# Altium schematic sheet Sheet1.SchDoc
size A4; SheetNumber: 1; SheetTotal: 1
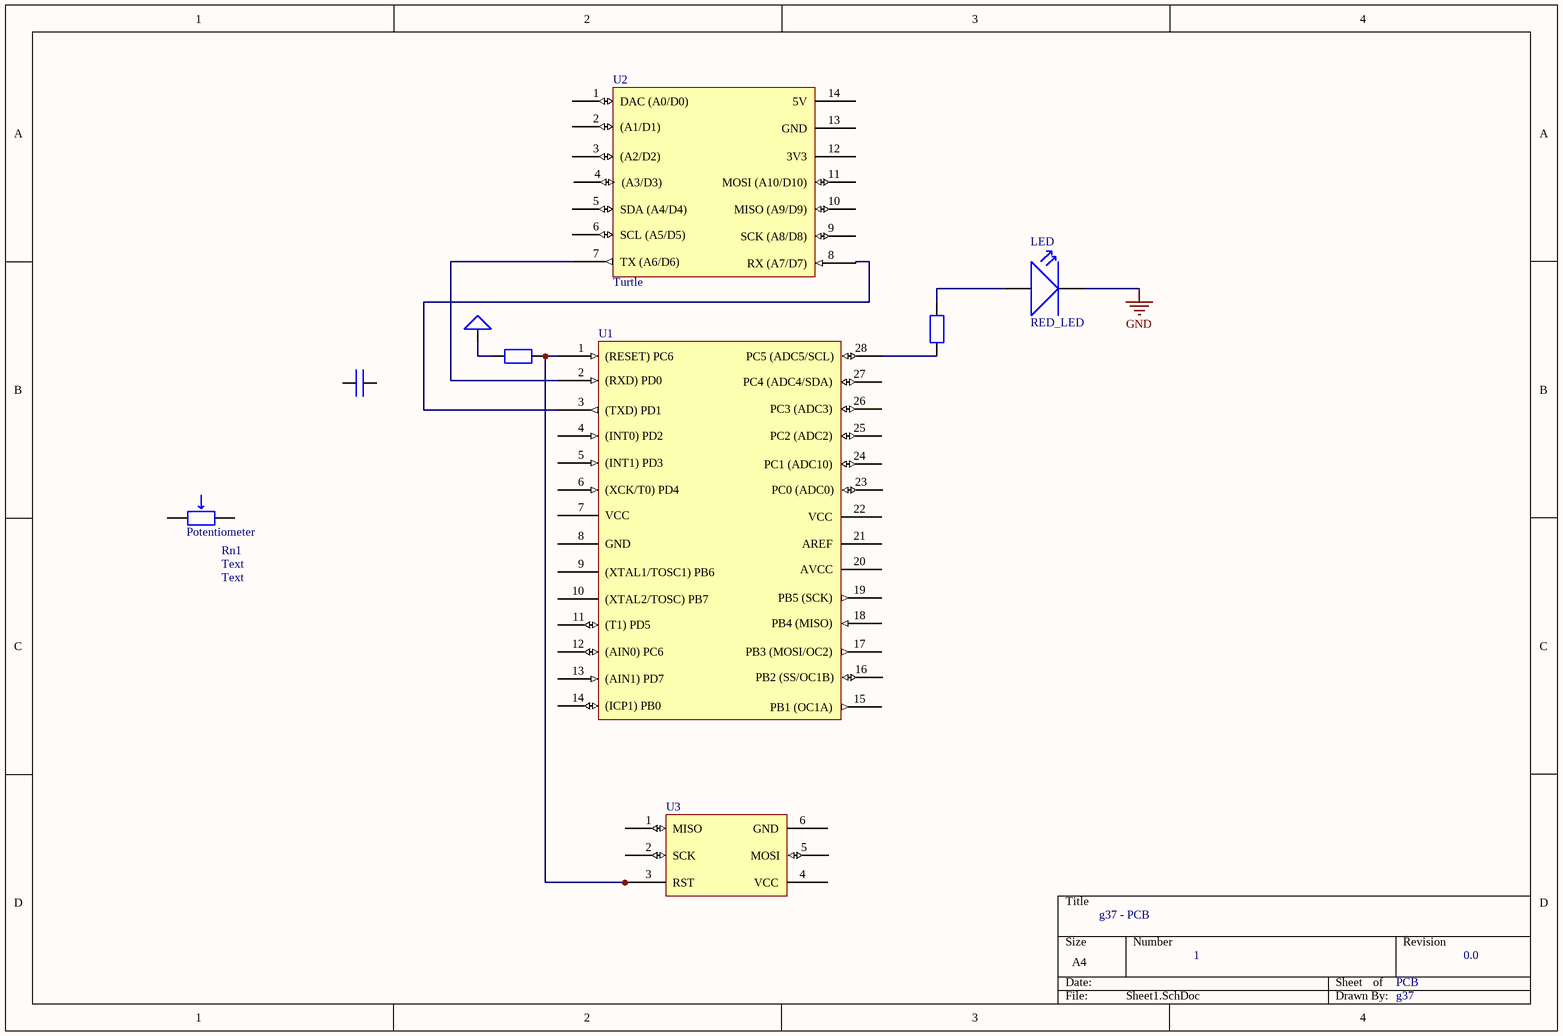
[diagram p0: Sheet1.SchDoc]

## Parts
*  Power Port  (value not drawn)
C1  Capacitor  (value not drawn)
LED  RED_LED
R1  Resistor  (value not drawn)
R?  Resistor  (value not drawn)
Rn1  Potentiometer
U1  Microcontroller  (value not drawn)
U2  Turtle
U3  Encoder  (value not drawn)

## Nets
GND: LED.1
Net*_12: *.12 R?.8
NetLED_1: LED.1 R1.9
NetR1_8: R1.8 U1.28(PC5_(ADC5/SCL))
NetR?_9: R?.9 U1.1((RESET)_PC6) U3.3(RST)
NetU1_2: U1.2((RXD)_PD0) U2.7(TX_(A6/D6))
NetU1_3: U1.3((TXD)_PD1) U2.8(RX_(A7/D7))

Not connected (* = marked no-connect by the designer): C1 10 11; Rn1 0 1; U1 4((INT0)_PD2) 5((INT1)_PD3) 6((XCK/T0)_PD4) 7(VCC) 8(GND) 9((XTAL1/TOSC1)_PB6) 10((XTAL2/TOSC)_PB7) 11((T1)_PD5) 12((AIN0)_PC6) 13((AIN1)_PD7) 14((ICP1)_PB0) 15(PB1_(OC1A)) 16(PB2_(SS/OC1B)) 17(PB3_(MOSI/OC2)) 18(PB4_(MISO)) 19(PB5_(SCK)) 20(AVCC) 21(AREF) 22(VCC) 23(PC0_(ADC0)) 24(PC1_(ADC10)) 25(PC2_(ADC2)) 26(PC3_(ADC3)) 27(PC4_(ADC4/SDA)); U2 1(DAC_(A0/D0)) 2((A1/D1)) 3((A2/D2)) 4((A3/D3)) 5(SDA_(A4/D4)) 6(SCL_(A5/D5)) 9(SCK_(A8/D8)) 10(MISO_(A9/D9)) 11(MOSI_(A10/D10)) 12(3V3) 13(GND) 14(5V); U3 1(MISO) 2(SCK) 4(VCC) 5(MOSI) 6(GND)

## Notes on the sheet
- (near Rn1) Text
- Text
- g37 - PCB
- 1
- PCB
- 0.0
- g37

## Library data of the parts
Rn1 = 3006P-1-203LF: Cermet trimmer potentiometer, 15 turns, 20 kΩ, 0.75 W, THT, lateral, 3006P-1-203LF; Manufacturer: Bourns; Lead Diameter: 510µm; Lead Length: 5.33mm; Max Power Dissipation: 750mW; Number of Turns: 15; Pitch: 2.5mm; Resistance: 20kΩ; Temperature Coefficient: 100ppm/°C; Tolerance: 10%; Voltage Rating: 400V; Supplier 1: DigiKey; Manufacturer Part Number: 3006P-1-203LF; RoHS: Compliant; Category: Variable Resistors and Potentiometers; Stock 1: 8166; Pricing 1: 1=1.78, 10=1.487, 25=1.3824, 50=1.3074, 100=1.2361, 250=1.14736, 500=1.0842, 1000=1.02432, 5000=0.89728 (USD); Color: Blue; Composition: Cermet; Contact Plating: Tin; Depth: 4.83mm; Height: 6.35mm; Length: 19.05mm; Lifecycle Status: Production; Max Operating Temperature: 125°C; Military Standard: Not; Min Operating Temperature: -55°C; Mount: PCB, Panel, Through Hole; Number of Terminals: 3; Power Dissipation: 750mW; Power Rating: 750mW; Radiation Hardening: No; REACH SVHC: No; Schedule B: 8533400080, 8533400080|8533400080|8533400080|8533400080|8533400080|8533400080|8533400080|8533400080|8533400080|8533400080|8533400080|8533400080|8533400080|8533400080|8533400080|8533400080|8533400080|8533400080|8533400080|8533400080|8533400080|8533400080|8533400080|85; Taper: Linear; Termination: Pin; Thickness: 5.59mm; Type: Potentiometer; Voltage Rating (DC): 400V; Weight: 1.133981g; Width: 4.83mm; Working Voltage: 400V; ComponentLink1URL: https://datasheet.octopart.com:443/3006P-1-203LF-Bourns-datasheet-179130280.pdf?src-supplier=IHS; ComponentLink1Description: https://datasheet.octopart.com:443/3006P-1-203LF-Bourns-datasheet-179130280.pdf?src-supplier=IHS; ComponentLink2URL: https://datasheet.octopart.com:443/3006P-1-203LF-Bourns-datasheet-1556.pdf?src-supplier=Master+Electronics; ComponentLink2Description: https://datasheet.octopart.com:443/3006P-1-203LF-Bourns-datasheet-1556.pdf?src-supplier=Master+Electronics; ComponentLink3URL: https://datasheet.octopart.com:443/3006P-1-203LF-Bourns-datasheet-8820935.pdf?src-supplier=Burklin+Elektronik; ComponentLink3Description: https://datasheet.octopart.com:443/3006P-1-203LF-Bourns-datasheet-8820935.pdf?src-supplier=Burklin+Elektronik; ComponentLink4URL: https://datasheet.octopart.com:443/3006P-1-203LF-Bourns-datasheet-177039006.pdf?src-supplier=Burklin+Elektronik; ComponentLink4Description: https://datasheet.octopart.com:443/3006P-1-203LF-Bourns-datasheet-177039006.pdf?src-supplier=Burklin+Elektronik; ComponentLink5URL: https://datasheet.octopart.com:443/3006P-1-203LF-Bourns-datasheet-25360148.pdf?src-supplier=Newark; ComponentLink5Description: https://datasheet.octopart.com:443/3006P-1-203LF-Bourns-datasheet-25360148.pdf?src-supplier=Newark; ComponentLink6URL: https://datasheet.octopart.com:443/3006P-1-203LF-Bourns-datasheet-147334278.pdf?src-supplier=Amar+Radio+Corporation; ComponentLink6Description: https://datasheet.octopart.com:443/3006P-1-203LF-Bourns-datasheet-147334278.pdf?src-supplier=Amar+Radio+Corporation; ComponentLink7URL: https://datasheet.octopart.com:443/3006P-1-203LF-Bourns-datasheet-37485062.pdf?src-supplier=RS+(Formerly+Allied+Electronics); ComponentLink7Description: https://datasheet.octopart.com:443/3006P-1-203LF-Bourns-datasheet-37485062.pdf?src-supplier=RS+(Formerly+Allied+Electronics); ComponentLink8URL: https://datasheet.octopart.com:443/3006P-1-203LF-Bourns-datasheet-30238.pdf?src-supplier=RS+(Formerly+Allied+Electronics); ComponentLink8Description: https://datasheet.octopart.com:443/3006P-1-203LF-Bourns-datasheet-30238.pdf?src-supplier=RS+(Formerly+Allied+Electronics); ComponentLink9URL: https://datasheet.octopart.com:443/3006P-1-203LF-Bourns-datasheet-14175265.pdf?src-supplier=iiiC; ComponentLink9Description: https://datasheet.octopart.com:443/3006P-1-203LF-Bourns-datasheet-14175265.pdf?src-supplier=iiiC; ComponentLink10URL: https://datasheet.octopart.com:443/3006P-1-203LF-Bourns-datasheet-8372838.pdf?src-supplier=Verical; ComponentLink10Description: https://datasheet.octopart.com:443/3006P-1-203LF-Bourns-datasheet-8372838.pdf?src-supplier=Verical; ComponentLink11URL: https://datasheet.octopart.com:443/3006P-1-203LF-Bourns-datasheet-10033440.pdf?src-supplier=Jameco; ComponentLink11Description: https://datasheet.octopart.com:443/3006P-1-203LF-Bourns-datasheet-10033440.pdf?src-supplier=Jameco; ComponentLink12URL: http://sigma.octopart.com:80/conflict_mineral_statement/Bourns-company-36.pdf?src-supplier=Compliance+Statements; ComponentLink12Description: http://sigma.octopart.com:80/conflict_mineral_statement/Bourns-company-36.pdf?src-supplier=Compliance+Statements; Supplier Part Number 1: 3006P-203LF-ND
U1 = ATMEGA328P-PU: Microchip - ATMEGA328P-PU - Microcontroller Mcu, 8 Bit, Atmega, 20MHZ, DIP-28; Manufacturer Lifecycle Status: REL; Core Architecture: AVR; Data Bus Width: 8b; Interface: 2-Wire, I2C, SPI, UART, USART; Max Supply Voltage: 5.5V; Memory Size: 32kB; Memory Type: FLASH; Min Supply Voltage: 1.8V; Number of ADC Channels: 6; Number of I2C Channels: 1; Number of I/Os: 23; Number of Timers/Counters: 3; Oscillator Type: Internal; Peripherals: Brown-out Detect/Reset, POR, PWM, WDT; RAM Size: 2kB; Watchdog Timer: Yes; Supplier 1: DigiKey; Manufacturer: Microchip; Manufacturer Part Number: ATMEGA328P-PU; RoHS: Compliant; Category: Microcontrollers; Stock 1: 49916; Pricing 1: 1=2.89, 25=2.65, 100=2.39 (USD); Projected EOL Date: 2039-11-04; Case/Package: PDIP; Contact Plating: Tin; Country of Assembly: Thailand; Country of Fabrication: United States of America; Country of Origin: Thailand; Export Control Classification Number (ECCN) Code: EAR99; Frequency: 20MHz; Height: 3.28mm; Harmonized Tariff Schedule (HTS) Code: 8542.31.0015; Lead Free: Lead Free; Length: 37.4mm; Lifecycle Status: Production; Max Frequency: 20MHz; Max Operating Temperature: 85°C; Min Operating Temperature: -40°C; Mount: Through Hole; Number of Pins: 28; Number of Programmable I/O: 23; Number of PWM Channels: 6; Number of SPI Channels: 1; Radiation Hardening: No; REACH SVHC: No; Schedule B: 8542310000, 8542310000|8542310000|8542310000|8542310000|8542310000; Width: 6.76mm; ComponentLink1URL: https://datasheet.octopart.com:443/ATMEGA328P-PU-Microchip-datasheet-147334532.pdf?src-supplier=Microchip; ComponentLink1Description: https://datasheet.octopart.com:443/ATMEGA328P-PU-Microchip-datasheet-147334532.pdf?src-supplier=Microchip; ComponentLink2URL: https://datasheet.octopart.com:443/ATMEGA328P-PU-Microchip-datasheet-148646239.pdf?src-supplier=Microchip; ComponentLink2Description: https://datasheet.octopart.com:443/ATMEGA328P-PU-Microchip-datasheet-148646239.pdf?src-supplier=Microchip; ComponentLink3URL: https://datasheet.octopart.com:443/ATMEGA328P-PU-Microchip-datasheet-68295846.pdf?src-supplier=SHENGYU+ELECTRONICS; ComponentLink3Description: https://datasheet.octopart.com:443/ATMEGA328P-PU-Microchip-datasheet-68295846.pdf?src-supplier=SHENGYU+ELECTRONICS; ComponentLink4URL: https://datasheet.octopart.com:443/ATMEGA328P-PU-Microchip-datasheet-14421303.pdf?src-supplier=Upverter; ComponentLink4Description: https://datasheet.octopart.com:443/ATMEGA328P-PU-Microchip-datasheet-14421303.pdf?src-supplier=Upverter; ComponentLink5URL: https://datasheet.octopart.com:443/ATMEGA328P-PU-Atmel-datasheet-34147914.pdf?src-supplier=Upverter; ComponentLink5Description: https://datasheet.octopart.com:443/ATMEGA328P-PU-Atmel-datasheet-34147914.pdf?src-supplier=Upverter; ComponentLink6URL: https://datasheet.octopart.com:443/ATMEGA328P-PU-Atmel-datasheet-14353408.pdf?src-supplier=Upverter; ComponentLink6Description: https://datasheet.octopart.com:443/ATMEGA328P-PU-Atmel-datasheet-14353408.pdf?src-supplier=Upverter; ComponentLink7URL: https://datasheet.octopart.com:443/ATMEGA328P-PU-Microchip-datasheet-133520744.pdf?src-supplier=LKR; ComponentLink7Description: https://datasheet.octopart.com:443/ATMEGA328P-PU-Microchip-datasheet-133520744.pdf?src-supplier=LKR; ComponentLink8URL: https://datasheet.octopart.com:443/ATMEGA328P-PU-Microchip-datasheet-62316222.pdf?src-supplier=element14+APAC; ComponentLink8Description: https://datasheet.octopart.com:443/ATMEGA328P-PU-Microchip-datasheet-62316222.pdf?src-supplier=element14+APAC; ComponentLink9URL: https://datasheet.octopart.com:443/ATMEGA328P-PU-Atmel-datasheet-13381135.pdf?src-supplier=element14+APAC; ComponentLink9Description: https://datasheet.octopart.com:443/ATMEGA328P-PU-Atmel-datasheet-13381135.pdf?src-supplier=element14+APAC; ComponentLink10URL: https://datasheet.octopart.com:443/ATMEGA328P-PU-Microchip-datasheet-154741723.pdf?src-supplier=Electro+Sonic; ComponentLink10Description: https://datasheet.octopart.com:443/ATMEGA328P-PU-Microchip-datasheet-154741723.pdf?src-supplier=Electro+Sonic; ComponentLink11URL: https://datasheet.octopart.com:443/ATMEGA328P-PU-Microchip-datasheet-100453898.pdf?src-supplier=Burklin+Elektronik; ComponentLink11Description: https://datasheet.octopart.com:443/ATMEGA328P-PU-Microchip-datasheet-100453898.pdf?src-supplier=Burklin+Elektronik; ComponentLink12URL: https://datasheet.octopart.com:443/ATMEGA328P-PU-Atmel-datasheet-30457899.pdf?src-supplier=Seeed+Studio; ComponentLink12Description: https://datasheet.octopart.com:443/ATMEGA328P-PU-Atmel-datasheet-30457899.pdf?src-supplier=Seeed+Studio; ComponentLink13URL: https://datasheet.octopart.com:443/ATMEGA328P-PU-Microchip-datasheet-10842036.pdf?src-supplier=SOS+electronic; ComponentLink13Description: https://datasheet.octopart.com:443/ATMEGA328P-PU-Microchip-datasheet-10842036.pdf?src-supplier=SOS+electronic; ComponentLink14URL: https://datasheet.octopart.com:443/ATMEGA328P-PU-Microchip-datasheet-8364063.pdf?src-supplier=Jameco; ComponentLink14Description: https://datasheet.octopart.com:443/ATMEGA328P-PU-Microchip-datasheet-8364063.pdf?src-supplier=Jameco; ComponentLink15URL: https://datasheet.octopart.com:443/ATMEGA328P-PU-Microchip-datasheet-154323124.pdf?src-supplier=Jameco; ComponentLink15Description: https://datasheet.octopart.com:443/ATMEGA328P-PU-Microchip-datasheet-154323124.pdf?src-supplier=Jameco; ComponentLink16URL: https://datasheet.octopart.com:443/ATMEGA328P-PU-Atmel-datasheet-10389530.pdf?src-supplier=Newark; ComponentLink16Description: https://datasheet.octopart.com:443/ATMEGA328P-PU-Atmel-datasheet-10389530.pdf?src-supplier=Newark; ComponentLink17URL: https://datasheet.octopart.com:443/ATMEGA328P-PU-Microchip-datasheet-65729177.pdf?src-supplier=TME; ComponentLink17Description: https://datasheet.octopart.com:443/ATMEGA328P-PU-Microchip-datasheet-65729177.pdf?src-supplier=TME; ComponentLink18URL: https://datasheet.octopart.com:443/ATMEGA328P-PU-Microchip-datasheet-101746195.pdf?src-supplier=Future+Electronics; ComponentLink18Description: https://datasheet.octopart.com:443/ATMEGA328P-PU-Microchip-datasheet-101746195.pdf?src-supplier=Future+Electronics; ComponentLink19URL: http://sigma.octopart.com:80/188450569/materials_sheet/Microchip-ATMEGA328P-PU.pdf?src-supplier=Compliance+Statements; ComponentLink19Description: http://sigma.octopart.com:80/188450569/materials_sheet/Microchip-ATMEGA328P-PU.pdf?src-supplier=Compliance+Statements; ComponentLink20URL: http://sigma.octopart.com:80/rohs_statement/Microchip-company-71.pdf?src-supplier=Compliance+Statements; ComponentLink20Description: http://sigma.octopart.com:80/rohs_statement/Microchip-company-71.pdf?src-supplier=Compliance+Statements; ComponentLink21URL: http://sigma.octopart.com:80/reach_statement/Microchip-company-70.pdf?src-supplier=Compliance+Statements; ComponentLink21Description: http://sigma.octopart.com:80/reach_statement/Microchip-company-70.pdf?src-supplier=Compliance+Statements; ComponentLink22URL: http://sigma.octopart.com:80/conflict_mineral_statement/Microchip-company-69.pdf?src-supplier=Compliance+Statements; ComponentLink22Description: http://sigma.octopart.com:80/conflict_mineral_statement/Microchip-company-69.pdf?src-supplier=Compliance+Statements; ComponentLink23URL: http://sigma.octopart.com:80/conflict_mineral_statement/Microchip-company-68.pdf?src-supplier=Compliance+Statements; ComponentLink23Description: http://sigma.octopart.com:80/conflict_mineral_statement/Microchip-company-68.pdf?src-supplier=Compliance+Statements; ComponentLink24URL: http://sigma.octopart.com:80/reach_statement/Atmel-company-6.pdf?src-supplier=Compliance+Statements; ComponentLink24Description: http://sigma.octopart.com:80/reach_statement/Atmel-company-6.pdf?src-supplier=Compliance+Statements; ComponentLink25URL: http://sigma.octopart.com:80/rohs_statement/Atmel-company-5.pdf?src-supplier=Compliance+Statements; ComponentLink25Description: http://sigma.octopart.com:80/rohs_statement/Atmel-company-5.pdf?src-supplier=Compliance+Statements; ComponentLink26URL: http://sigma.octopart.com:80/rohs_statement/Atmel-company-4.pdf?src-supplier=Compliance+Statements; ComponentLink26Description: http://sigma.octopart.com:80/rohs_statement/Atmel-company-4.pdf?src-supplier=Compliance+Statements; Supplier Part Number 1: ATMEGA328P-PU-ND
U2 = 102010328: SAMD21 Microcontroller Development Board 0.0327MHz/48MHzCPU 32KB RAM 256KB Flash; Manufacturer: Seeed Studio; Supplier 1: DigiKey; Manufacturer Part Number: 102010328; Category: DSPs - Digital Signal Processors; Stock 1: 4270; Pricing 1: 1=5.4 (USD); Schedule B: 8471490000; Supplier Part Number 1: 1597-102010328-ND
U3 = 1465: Adafruit 6-Pin Avr Isp Breadboard Adapter Mini Kit |Adafruit 1465; Manufacturer: Adafruit Industries; Supplier 1: DigiKey; Manufacturer Part Number: 1465; RoHS: Compliant; Category: Uncategorized; Stock 1: 113; Pricing 1: 1=0.95 (USD); Schedule B: 8542900000, 8542900000|8542900000|8542900000|8542900000|8542900000; Supplier Part Number 1: 1528-1189-ND